# Altium project LPC-LINK-2_SHIELD.PrjPcb
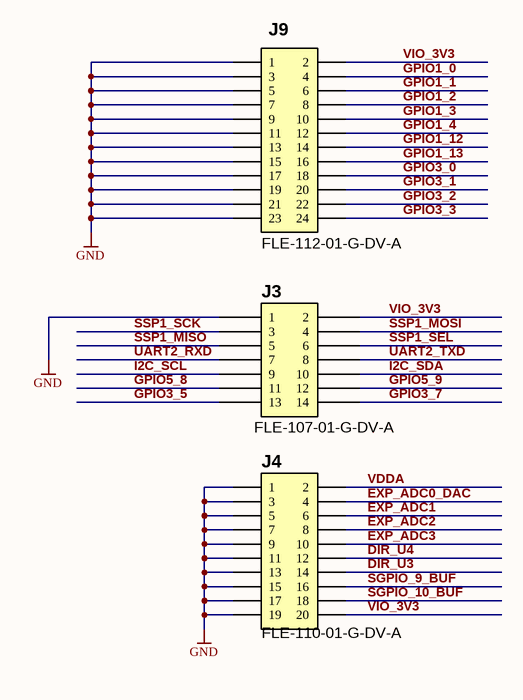
[diagram p0: LPC-LINK-2_SHIELD.SchDoc]
1 sheet, 3 parts. Net scope: global (net labels, ports and power ports of the same name join across sheets).
Board file: LPC-LINK-2_SHIELD.PcbDoc

## Sheet LPC-LINK-2_SHIELD.SchDoc
size D

### Parts
J3  FLE-107-01-G-DV-A  [FLE-107-01-G-DV-A]
J4  FLE-110-01-G-DV-A  [FLE-110-01-G-DV-A]
J9  FLE-112-01-G-DV-A  [FLE-112-01-G-DV-A]

### Nets
GND: J3.1 J4.1 J4.3 J4.5 J4.7 J4.9 J4.11 J4.13 J4.15 J4.17 J4.19 J9.1 J9.3 J9.5 J9.7 J9.9 J9.11 J9.13 J9.15 J9.17 J9.19 J9.21 J9.23
DIR_U3: J4.14
DIR_U4: J4.12
EXP_ADC0_DAC: J4.4
EXP_ADC1: J4.6
EXP_ADC2: J4.8
EXP_ADC3: J4.10
GPIO1_0: J9.4
GPIO1_1: J9.6
GPIO1_2: J9.8
GPIO1_3: J9.10
GPIO1_4: J9.12
GPIO1_12: J9.14
GPIO1_13: J9.16
GPIO3_0: J9.18
GPIO3_1: J9.20
GPIO3_2: J9.22
GPIO3_3: J9.24
GPIO3_5: J3.13
GPIO3_7: J3.14
GPIO5_8: J3.11
GPIO5_9: J3.12
I2C_SCL: J3.9
I2C_SDA: J3.10
SGPIO_9_BUF: J4.16
SGPIO_10_BUF: J4.18
SSP1_MISO: J3.5
SSP1_MOSI: J3.4
SSP1_SCK: J3.3
SSP1_SEL: J3.6
UART2_RXD: J3.7
UART2_TXD: J3.8
VDDA: J4.2
VIO_3V3: J3.2 J4.20 J9.2

### Notes on the sheet
- -1
- Wavenumber LLC
- 2pl
- Rev:
- Sheet
- of

### Library data of the parts
J3 = FLE-107-01-G-DV-A: SAMTEC - FLE-107-01-G-DV-A - .050 MICRO STRIPS; Supplier 1: Newark; Supplier Part Number 1: 99P6817; Manufacturer: SAMTEC; Manufacturer Part Number: FLE-107-01-G-DV-A; Stock: 0; Pricing: 1=3.04, 10=2.66, 100=2.25, 500=1.94, 1000=1.68, 5000=1.5, 10000=1.42 (USD); Value: FLE-107-01-G-DV-A
J4 = FLE-110-01-G-DV-A: SAMTEC - FLE-110-01-G-DV-A - .050 MICRO STRIPS; Supplier 1: Newark; Supplier Part Number 1: 99P6854; Manufacturer: SAMTEC; Manufacturer Part Number: FLE-110-01-G-DV-A; Stock: 0; Pricing: 1=3.73, 10=3.27, 100=2.76, 500=2.38, 1000=2.07, 5000=1.84, 10000=1.75 (USD); Value: FLE-110-01-G-DV-A
J9 = FLE-112-01-G-DV-A: SAMTEC - FLE-112-01-G-DV-A - .050 MICRO STRIPS; Supplier 1: Newark; Supplier Part Number 1: 99P6889; Manufacturer: SAMTEC; Manufacturer Part Number: FLE-112-01-G-DV-A; Stock: 0; Pricing: 1=4.37, 10=3.82, 100=3.24, 500=2.78, 1000=2.42, 5000=2.15, 10000=2.04 (USD); Value: FLE-112-01-G-DV-A